# Altium schematic sheet task1_sh1.SchDoc: Task_1 Schematic Diagram_V2
size A
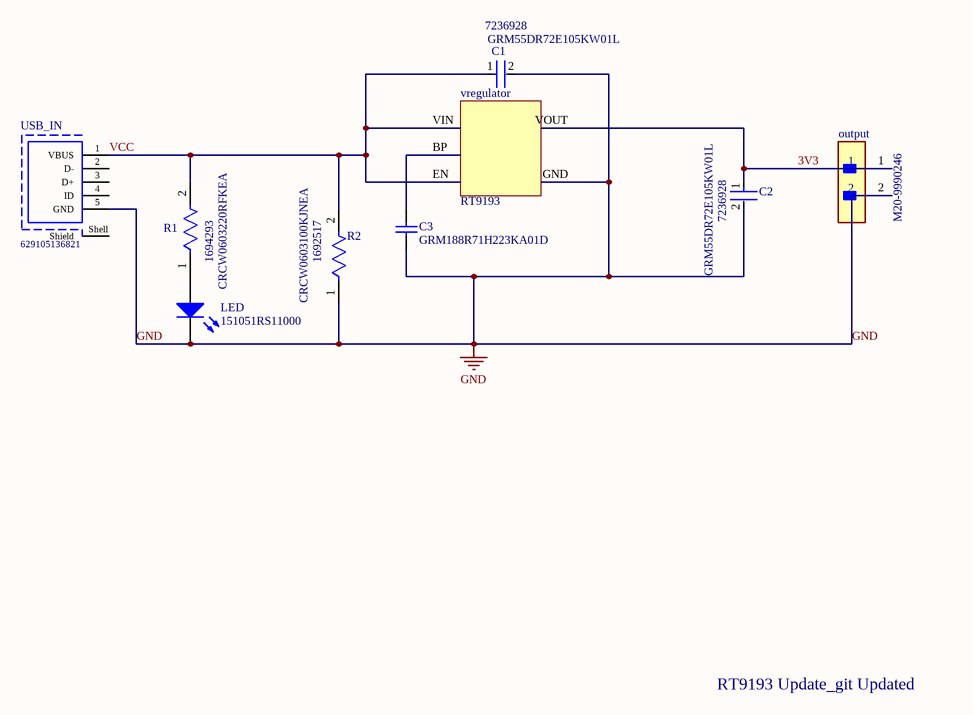
[diagram p0: task1_sh1.SchDoc]

## Parts
C1  GRM55DR72E105KW01L  Supplier Part Number 1: 7236928  [FP-GRM55D-0_4-IPC_A]
C2  GRM55DR72E105KW01L  Supplier Part Number 1: 7236928  [FP-GRM55D-0_4-IPC_A]
C3  GRM188R71H223KA01D  [CAPC1608X90X35ML10T15]
LED  151051RS11000  [Type 5mm]
output  M20-9990246  [FP-M20-9990246-MFG]
R1  CRCW0603220RFKEA  Supplier Part Number 1: 1694293  [FP-CRCW0603-e3-MFG]
R2  CRCW0603100KJNEA  Supplier Part Number 1: 1692517  [FP-CRCW0603-e3-IPC_C]
USB_IN  629105136821  [629105136821]
vregulator  RT9193  [9193new]

## Nets
GND: C1.2 C2.2 C3.1 LED.1(K) output.2 R2.1 USB_IN.5(GND) vregulator.GND
3V3: C2.1 output.1 vregulator.VOUT
VCC: C1.1 R1.2 R2.2 USB_IN.1(VBUS) vregulator.EN vregulator.VIN
NetC3_2: C3.2 vregulator.BP
NetLED_2: LED.2(A) R1.1

Not connected (* = marked no-connect by the designer): USB_IN 2(D-) 3(D+) 4(ID) Shell(Shield)

## Notes on the sheet
- RT9193 Update_git Updated

## Library data of the parts
C1 C2 = CMP-2000-06370-2: Chip Multilayer Ceramic Capacitors for General Purpose, 2220, 1.0uF, X7R, 15%, 10%, 250V; Capacitance: 1uF; Width: 5mm; Height: 2mm; Case Code (Imperial): 2220; Voltage Rating (DC): 250V; Max Operating Temperature: 125°C; Number of Pins: 2; Min Operating Temperature: -55°C; Termination: SMD/SMT; Case/Package: 2220; Dielectric: X7R; Material: Ceramic; REACH SVHC: No SVHC; Voltage: 250V; Packaging: Tape and Reel; Thickness: 0.087inch; Depth: 5mm; Package Quantity: 1; Tolerance: 10%; Mount: Surface Mount; Voltage Rating: 250V; Length: 5.7mm; Case Code (Metric): 5750; Lead Free: Lead Free; Supplier 1: RSComponents
C3 = CMP-2006-02910-1: Manufacturer: Murata; Part Number: GRM188R71H223KA01D; Supplier 1: Arrow Electronics
LED = CMP-1488-00008-1: THT LED round mono-color color lens, WL-TMRW, Red; Manufacturer: Wuerth Elektronik; PackageReference: Type 5mm; PartNumber: 151051RS11000; ComponentLink2URL: http://katalog.we-online.de/pbs/datasheet/7448042001.pdfhttp://katalog.we-online.de/pbs/datasheet/7448042001.pdfhttp://katalog.we-online.de/pbs/datasheet/7448042001.pdfhttp://katalog.we-online.de/pbs/datasheet/151051RS11000.pdf; ComponentLink1URL: http://www.we-online.com; ComponentLink1Description: Manufacturer URL; ComponentLink2Description: Datasheet; Emitting color: Red
output = CMP-15831-000009-1: CONN HEADER VERT 2POS 2.54MM; Manufacturer: Harwin; Conn Gender: Male; Conn Orientation: Vertical; Number Of Contacts: 2; Current Rating: 3A; ComponentLink2URL: https://cdn.harwin.com/pdfs/M20-999.pdf; ComponentLink2Description: Datasheet; Package: M20-9990246; Temperature: -40°C to +105°C; Octopart: https://octopart.com/m20-9990246-harwin-2590635; Mouser Description: 2.54mm (0.1") Pitch SIL Vertical PC Tail Pin Header, 6.1mm mating pin height, tin, 2 contacts; Temperature Range High: +105°C; Device Class L1: Connectors; RoHS: TRUE; Automotive: No; Height: 8.99mm; Number Of Rows: 1; Contact Material: Tin,Nickel; Category: Conn; Pitch: 2.54mm; Lead Free: Yes; Digikey Description: CONN HEADER VERT 2POS 2.54MM; Manufacturer Part Number: M20-9990246; Temperature Range Low: -40°C; Device Class L3: unset; Device Class L2: Headers and Wire Housings
R1 = CMP-2000-03085-2: RES Thick Film, 220Ω, 1%, 0.1W, 100ppm/°C, 0603; Power Rating: 100mW; Voltage Rating: 75V; Resistance: 220R; Contact Plating: Tin; Package Quantity: 10; Lead Free: Lead Free; Packaging: Tape and Reel; Max Operating Temperature: 155°C; Case/Package: 0603; Radiation Hardening: No; Height: 0.45mm; Width: 0.033inch; Case Code (Imperial): 0603; Number of Terminations: 2; Tolerance: 1%; Min Operating Temperature: -55°C; Termination: SMD/SMT; Length: 1.55mm; Features: Automotive AEC-Q200; Voltage Rating (DC): 75V; Case Code (Metric): 1608; Composition: Thick Film; Military Standard: Not; Temperature Coefficient: 100ppm/°C; Depth: 0.85mm; Weight: 7.1E-05oz; Max Power Dissipation: 100mW; Supplier 1: RSComponents
R2 = CMP-2000-03823-2: RES Thick Film, 100kΩ, 5%, 0.1W, 200ppm/°C, 0603; Power Rating: 100mW; Voltage Rating: 75V; Resistance: 100kR; Radiation Hardening: No; Min Operating Temperature: -55°C; Width: 0.85mm; Case Code (Metric): 1608; Max Power Dissipation: 100mW; Composition: Thick Film; Temperature Coefficient: 200ppm/°C; Tolerance: 5%; Termination: SMD/SMT; Military Standard: Not; Weight: 7.1E-05oz; Number of Pins: 2; Mount: Surface Mount; Depth: 0.85mm; Max Operating Temperature: 155°C; Case/Package: 0603; Working Voltage: 75V; Number of Terminations: 2; Package Quantity: 1; Case Code (Imperial): 0603; Contact Plating: Tin; Length: 1.55mm; Packaging: Tape and Reel; Height: 0.02inch; Features: Automotive AEC-Q200; Supplier 1: Farnell
USB_IN = CMP-1502-03253-1: Micro USB 2.0 Type B Receptacle WR-COM, Horizontal, SMT, with Pads and Pegs; Manufacturer: Wurth Elektronik; Contact Resistance: 30mOhm; Rated Current: 1A; Working Voltage: 30VAC; Datasheet URL: https://katalog.we-online.de/em/datasheet/629105136821.pdf; Mounting Technology: SMT; Publisher: WurthElektronik; Package Reference: 629105136821; Orientation: Horizontal; Packaging: TapeandReel; Part Number: 629105136821; Manufacturer URL: http://www.we-online.de; Connector Type: MicroUSB2.0TypeB; Gender: Receptacle; Operating Temperature: -40to105degC
vregulator = Component_1: ComponentLink1Description: RT9193-33GB; ComponentLink1URL: https://octopart.com/search?q=RT9193-33GB&filter%5Bfields%5D%5Bbrand.name%5D%5B%5D=Richtek